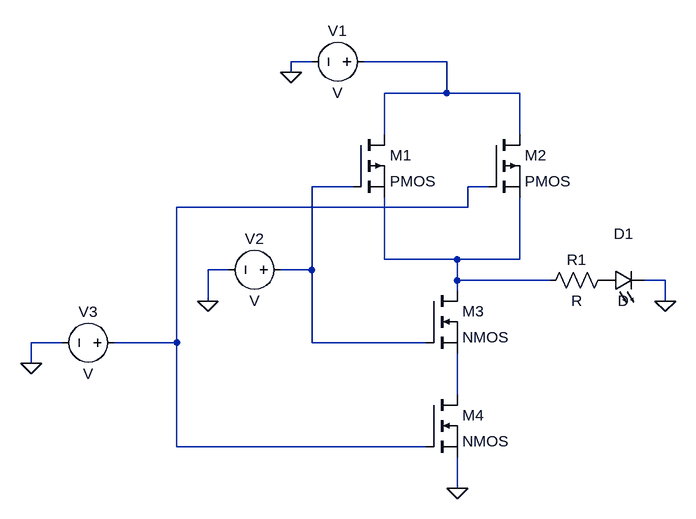
[diagram p0: schematic CMOS_NAND_Gate.asc]
CMOS_NAND_Gate.asc, the LTspice schematic file:
Version 4
SHEET 1 880 680
WIRE 96 -80 64 -80
WIRE 304 -80 176 -80
WIRE 64 -64 64 -80
WIRE 304 -32 304 -80
WIRE 304 -32 208 -32
WIRE 416 -32 304 -32
WIRE 208 32 208 -32
WIRE 416 32 416 -32
WIRE 160 112 96 112
WIRE 368 112 336 112
WIRE 336 144 336 112
WIRE 336 144 -112 144
WIRE 208 224 208 128
WIRE 320 224 208 224
WIRE 416 224 416 128
WIRE 416 224 320 224
WIRE -32 240 -64 240
WIRE 96 240 96 112
WIRE 96 240 48 240
WIRE 320 256 320 224
WIRE 464 256 320 256
WIRE 640 256 608 256
WIRE 320 272 320 256
WIRE -64 288 -64 240
WIRE 640 288 640 256
WIRE -288 352 -336 352
WIRE -112 352 -112 144
WIRE -112 352 -208 352
WIRE 96 352 96 240
WIRE 272 352 96 352
WIRE -336 384 -336 352
WIRE 320 432 320 368
WIRE -112 512 -112 352
WIRE 272 512 -112 512
WIRE 320 576 320 528
FLAG 320 576 0
FLAG 640 288 0
FLAG 64 -64 0
FLAG -64 288 0
FLAG -336 384 0
SYMBOL pmos 160 32 R0
SYMATTR InstName M1
SYMBOL pmos 368 32 R0
SYMATTR InstName M2
SYMBOL nmos 272 272 R0
SYMATTR InstName M3
SYMBOL nmos 272 432 R0
SYMATTR InstName M4
SYMBOL res 560 240 R90
WINDOW 0 0 56 VBottom 2
WINDOW 3 32 56 VTop 2
SYMATTR InstName R1
SYMBOL LED 544 272 R270
WINDOW 0 72 32 VTop 2
WINDOW 3 0 32 VBottom 2
SYMATTR InstName D1
SYMBOL voltage 192 -80 R90
WINDOW 0 -32 56 VBottom 2
WINDOW 3 32 56 VTop 2
SYMATTR InstName V1
SYMBOL voltage 64 240 R90
WINDOW 0 -32 56 VBottom 2
WINDOW 3 32 56 VTop 2
SYMATTR InstName V2
SYMBOL voltage -192 352 R90
WINDOW 0 -32 56 VBottom 2
WINDOW 3 32 56 VTop 2
SYMATTR InstName V3

The netlist it stands for:
* CMOS_NAND_Gate.asc
M1 N001 N002 N004 N004 PMOS
M2 N001 N003 N004 N004 PMOS
M3 N004 N002 N005 N005 NMOS
M4 N005 N003 0 0 NMOS
R1 P001 N004 R
D1 P001 0 D
V1 N001 0 V
V2 N002 0 V
V3 N003 0 V
.model D D
.lib standard.dio
.model NMOS NMOS
.model PMOS PMOS
.lib standard.mos
.backanno
.end